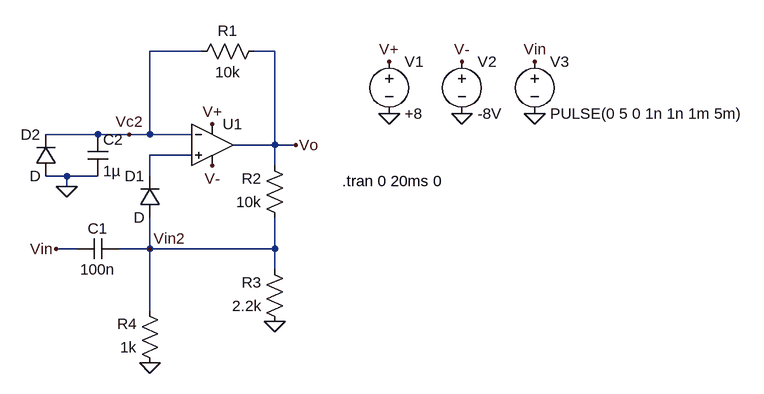
[diagram p0: schematic Monostable Multivibrator with OpAmp.asc]
Monostable Multivibrator with OpAmp.asc, the LTspice schematic file:
Version 4.1
SHEET 1 1080 680
WIRE 192 0 112 0
WIRE 304 0 272 0
WIRE 32 128 -48 128
WIRE 80 128 32 128
WIRE 112 128 112 0
WIRE 112 128 80 128
WIRE 176 128 112 128
WIRE 304 144 304 0
WIRE 304 144 240 144
WIRE 336 144 304 144
WIRE 176 160 112 160
WIRE 304 176 304 144
WIRE -16 192 -48 192
WIRE 32 192 -16 192
WIRE 112 192 112 160
WIRE -16 208 -16 192
WIRE 0 304 -32 304
WIRE 112 304 112 256
WIRE 112 304 64 304
WIRE 304 304 304 256
WIRE 304 304 112 304
WIRE 304 336 304 304
WIRE 112 400 112 304
FLAG 304 416 0
FLAG 112 480 0
FLAG -16 208 0
FLAG 336 144 Vo
FLAG -32 304 Vin
FLAG 480 16 V+
FLAG 208 112 V+
FLAG 208 176 V-
FLAG 480 96 0
FLAG 592 96 0
FLAG 592 16 V-
FLAG 704 96 0
FLAG 704 16 Vin
FLAG 112 304 Vin2
FLAG 80 128 Vc2
SYMBOL OpAmps\\UniversalOpAmp2 208 144 R0
SYMATTR InstName U1
SYMBOL res 288 -16 R90
WINDOW 0 0 56 VBottom 2
WINDOW 3 32 56 VTop 2
SYMATTR InstName R1
SYMATTR Value 10k
SYMBOL res 320 272 R180
WINDOW 0 36 76 Left 2
WINDOW 3 36 40 Left 2
SYMATTR InstName R2
SYMATTR Value 10k
SYMBOL res 320 432 R180
WINDOW 0 36 76 Left 2
WINDOW 3 36 40 Left 2
SYMATTR InstName R3
SYMATTR Value 2.2k
SYMBOL res 128 496 R180
WINDOW 0 36 76 Left 2
WINDOW 3 36 40 Left 2
SYMATTR InstName R4
SYMATTR Value 1k
SYMBOL cap 64 288 R90
WINDOW 0 0 32 VBottom 2
WINDOW 3 32 32 VTop 2
SYMATTR InstName C1
SYMATTR Value 100n
SYMBOL cap 16 128 R0
SYMATTR InstName C2
SYMATTR Value 1µ
SYMBOL diode -32 192 R180
WINDOW 0 24 64 Left 2
WINDOW 3 24 0 Left 2
SYMATTR InstName D2
SYMBOL voltage 480 0 R0
WINDOW 123 0 0 Left 0
WINDOW 39 0 0 Left 0
SYMATTR InstName V1
SYMATTR Value +8
SYMBOL voltage 592 0 R0
WINDOW 123 0 0 Left 0
WINDOW 39 0 0 Left 0
SYMATTR InstName V2
SYMATTR Value -8V
SYMBOL voltage 704 0 R0
WINDOW 123 0 0 Left 0
WINDOW 39 0 0 Left 0
SYMATTR InstName V3
SYMATTR Value PULSE(0 5 0 1n 1n 1m 5m)
SYMBOL diode 128 256 R180
WINDOW 0 24 64 Left 2
WINDOW 3 24 0 Left 2
SYMATTR InstName D1
TEXT 408 200 Left 2 !.tran 0 20ms 0

The netlist it stands for:
* Monostable Multivibrator with OpAmp.asc
X§U1 N001 Vc2 V+ V- Vo level2 Avol=1Meg GBW=10Meg Slew=10Meg Ilimit=25m Rail=0 Vos=0 En=0 Enk=0 In=0 Ink=0 Rin=500Meg  ; pins In+ In- V+ V- OUT
R1 Vo Vc2 10k
R2 Vin2 Vo 10k
R3 0 Vin2 2.2k
R4 0 Vin2 1k
C1 Vin2 Vin 100n
C2 Vc2 0 1µ
D2 0 Vc2 D
V1 V+ 0 +8
V2 V- 0 -8V
V3 Vin 0 PULSE(0 5 0 1n 1n 1m 5m)
D1 Vin2 N001 D
.model D D
.lib standard.dio
.tran 0 20ms 0
.lib UniversalOpAmp2.lib
.backanno
.end